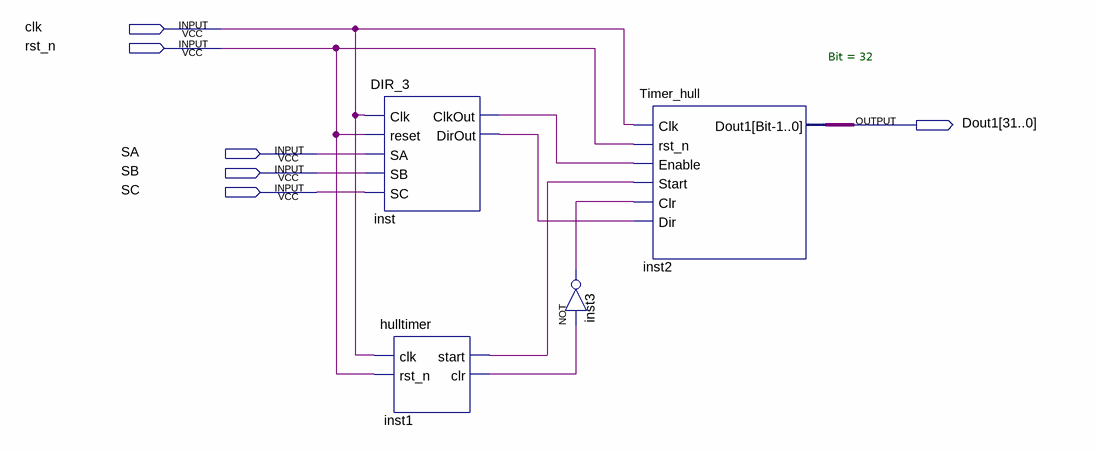
[diagram p0: schematic sheet]
// Quartus schematic testhull.bdf as structural Verilog: 4 symbols, 6 pins
module testhull (
  input  clk,
  input  rst_n,
  input  SA,
  input  SB,
  input  SC,
  output [31:0] Dout1
);

  wire inst1_clr, inst1_start, inst3_out, inst_clkout, inst_dirout;

  DIR_3 inst (.Clk(clk), .reset(rst_n), .SA(SA), .SB(SB), .SC(SC), .ClkOut(inst_clkout), .DirOut(inst_dirout));
  hulltimer inst1 (.clk(clk), .rst_n(rst_n), .start(inst1_start), .clr(inst1_clr));
  not inst3 (inst3_out, inst1_clr);
  Timer_hull #(.Bit(32)) inst2 (
    .Clk(clk), .rst_n(rst_n), .Enable(inst_clkout), .Start(inst1_start), .Clr(inst3_out), .Dir(inst_dirout),
    .Dout1(Dout1));
endmodule
